# Altium schematic sheet Display LED 8x8(20.00) x4.SchDoc
size 209 x 297 mm; Author: Мурашкин Д.В.; Address1: Address1; Address2: Address2; Address3: Address3; Address4: Address4; DocumentNumber: АБВГ.123456.001 Э3; Scale: 1:1; Letter1Column: Э; PartName: Деталь
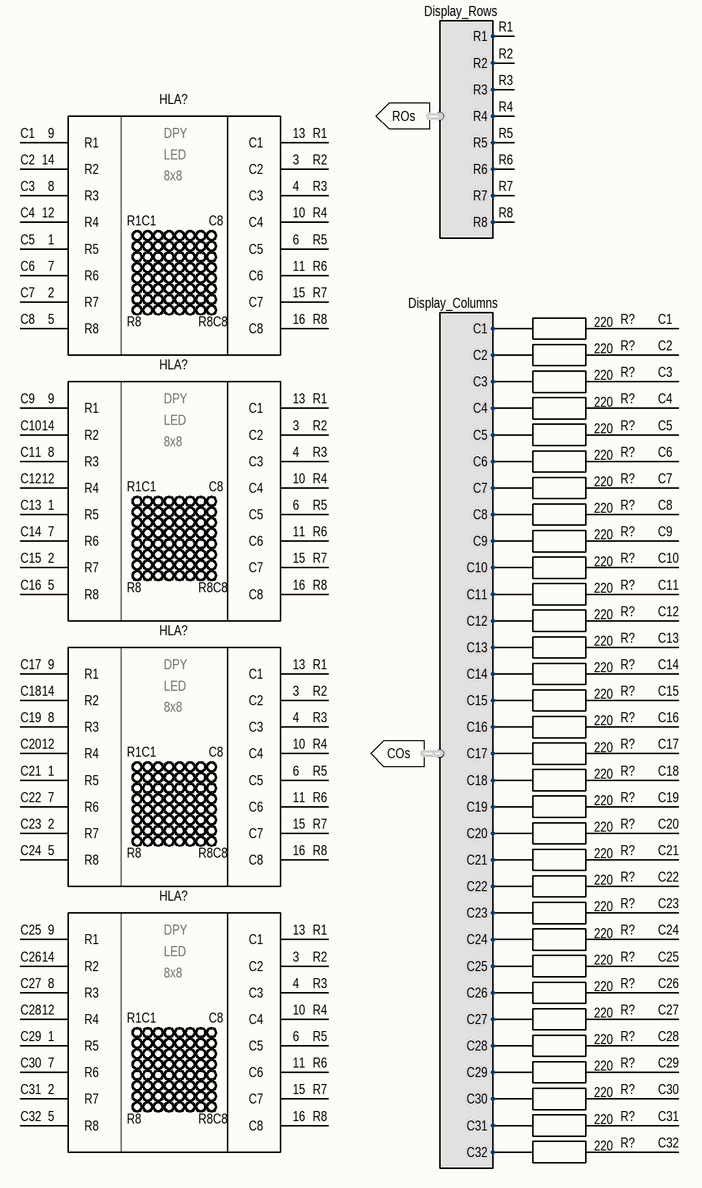
[diagram p0: Display LED 8x8(20.00) x4.SchDoc]

## Parts
(Parts that share a designator on the sheet are numbered #1, #2 ... from top to bottom, then left to right.)
HLA?#1  Blue  [DISP LED 8x8 1.9 DIP-16]  (value not drawn)
HLA?#2  Blue  [DISP LED 8x8 1.9 DIP-16]  (value not drawn)
HLA?#3  Blue  [DISP LED 8x8 1.9 DIP-16]  (value not drawn)
HLA?#4  Blue  [DISP LED 8x8 1.9 DIP-16]  (value not drawn)
R?#1  220  [RESC1608M]
R?#2  220  [RESC1608M]
R?#3  220  [RESC1608M]
R?#4  220  [RESC1608M]
R?#5  220  [RESC1608M]
R?#6  220  [RESC1608M]
R?#7  220  [RESC1608M]
R?#8  220  [RESC1608M]
R?#9  220  [RESC1608M]
R?#10  220  [RESC1608M]
R?#11  220  [RESC1608M]
R?#12  220  [RESC1608M]
R?#13  220  [RESC1608M]
R?#14  220  [RESC1608M]
R?#15  220  [RESC1608M]
R?#16  220  [RESC1608M]
R?#17  220  [RESC1608M]
R?#18  220  [RESC1608M]
R?#19  220  [RESC1608M]
R?#20  220  [RESC1608M]
R?#21  220  [RESC1608M]
R?#22  220  [RESC1608M]
R?#23  220  [RESC1608M]
R?#24  220  [RESC1608M]
R?#25  220  [RESC1608M]
R?#26  220  [RESC1608M]
R?#27  220  [RESC1608M]
R?#28  220  [RESC1608M]
R?#29  220  [RESC1608M]
R?#30  220  [RESC1608M]
R?#31  220  [RESC1608M]
R?#32  220  [RESC1608M]

## Ports
COs (harness Display_Columns), ROs (harness Display_Rows)

## Harnesses
Display_Rows: R1, R2, R3, R4, R5, R6, R7, R8
Display_Columns: C1, C2, C3, C4, C5, C6, C7, C8, C9, C10, C11, C12, C13, C14, C15, C16, C17, C18, C19, C20, C21, C22, C23, C24, C25, C26, C27, C28, C29, C30, C31, C32

## Nets
C1: HLA?#1.9(R1) R?#1.2
C2: HLA?#1.14(R2) R?#2.2
C3: HLA?#1.8(R3) R?#3.2
C4: HLA?#1.12(R4) R?#4.2
C5: HLA?#1.1(R5) R?#5.2
C6: HLA?#1.7(R6) R?#6.2
C7: HLA?#1.2(R7) R?#7.2
C8: HLA?#1.5(R8) R?#8.2
C9: HLA?#2.9(R1) R?#9.2
C10: HLA?#2.14(R2) R?#10.2
C11: HLA?#2.8(R3) R?#11.2
C12: HLA?#2.12(R4) R?#12.2
C13: HLA?#2.1(R5) R?#13.2
C14: HLA?#2.7(R6) R?#14.2
C15: HLA?#2.2(R7) R?#15.2
C16: HLA?#2.5(R8) R?#16.2
C17: HLA?#3.9(R1) R?#17.2
C18: HLA?#3.14(R2) R?#18.2
C19: HLA?#3.8(R3) R?#19.2
C20: HLA?#3.12(R4) R?#20.2
C21: HLA?#3.1(R5) R?#21.2
C22: HLA?#3.7(R6) R?#22.2
C23: HLA?#3.2(R7) R?#23.2
C24: HLA?#3.5(R8) R?#24.2
C25: HLA?#4.9(R1) R?#25.2
C26: HLA?#4.14(R2) R?#26.2
C27: HLA?#4.8(R3) R?#27.2
C28: HLA?#4.12(R4) R?#28.2
C29: HLA?#4.1(R5) R?#29.2
C30: HLA?#4.7(R6) R?#30.2
C31: HLA?#4.2(R7) R?#31.2
C32: HLA?#4.5(R8) R?#32.2
R1: HLA?#1.13(C1) HLA?#2.13(C1) HLA?#3.13(C1) HLA?#4.13(C1) ; port ROs.R1
R2: HLA?#1.3(C2) HLA?#2.3(C2) HLA?#3.3(C2) HLA?#4.3(C2) ; port ROs.R2
R3: HLA?#1.4(C3) HLA?#2.4(C3) HLA?#3.4(C3) HLA?#4.4(C3) ; port ROs.R3
R4: HLA?#1.10(C4) HLA?#2.10(C4) HLA?#3.10(C4) HLA?#4.10(C4) ; port ROs.R4
R5: HLA?#1.6(C5) HLA?#2.6(C5) HLA?#3.6(C5) HLA?#4.6(C5) ; port ROs.R5
R6: HLA?#1.11(C6) HLA?#2.11(C6) HLA?#3.11(C6) HLA?#4.11(C6) ; port ROs.R6
R7: HLA?#1.15(C7) HLA?#2.15(C7) HLA?#3.15(C7) HLA?#4.15(C7) ; port ROs.R7
R8: HLA?#1.16(C8) HLA?#2.16(C8) HLA?#3.16(C8) HLA?#4.16(C8) ; port ROs.R8
NetR?#1_1: R?#1.1 ; port COs.C1
NetR?#2_1: R?#2.1 ; port COs.C2
NetR?#3_1: R?#3.1 ; port COs.C3
NetR?#4_1: R?#4.1 ; port COs.C4
NetR?#5_1: R?#5.1 ; port COs.C5
NetR?#6_1: R?#6.1 ; port COs.C6
NetR?#7_1: R?#7.1 ; port COs.C7
NetR?#8_1: R?#8.1 ; port COs.C8
NetR?#9_1: R?#9.1 ; port COs.C9
NetR?#10_1: R?#10.1 ; port COs.C10
NetR?#11_1: R?#11.1 ; port COs.C11
NetR?#12_1: R?#12.1 ; port COs.C12
NetR?#13_1: R?#13.1 ; port COs.C13
NetR?#14_1: R?#14.1 ; port COs.C14
NetR?#15_1: R?#15.1 ; port COs.C15
NetR?#16_1: R?#16.1 ; port COs.C16
NetR?#17_1: R?#17.1 ; port COs.C17
NetR?#18_1: R?#18.1 ; port COs.C18
NetR?#19_1: R?#19.1 ; port COs.C19
NetR?#20_1: R?#20.1 ; port COs.C20
NetR?#21_1: R?#21.1 ; port COs.C21
NetR?#22_1: R?#22.1 ; port COs.C22
NetR?#23_1: R?#23.1 ; port COs.C23
NetR?#24_1: R?#24.1 ; port COs.C24
NetR?#25_1: R?#25.1 ; port COs.C25
NetR?#26_1: R?#26.1 ; port COs.C26
NetR?#27_1: R?#27.1 ; port COs.C27
NetR?#28_1: R?#28.1 ; port COs.C28
NetR?#29_1: R?#29.1 ; port COs.C29
NetR?#30_1: R?#30.1 ; port COs.C30
NetR?#31_1: R?#31.1 ; port COs.C31
NetR?#32_1: R?#32.1 ; port COs.C32

## Notes on the sheet
- Перв. примен.
- Справ. №
- Подп. и дата
- Инв. № дубл.
- Взам. инв. №
- Разраб.
- Изм.
- Лист
- № докум.
- Подп.
- Дата
- Лит.
- Масса
- Масштаб
- Пров.
- Т.контр.
- Листов
- Инв. № подл.
- Утв.
- Н.контр.
- 2.106-A4
- Копировал
- Формат А4
- (in symbol 788BB-3) DPY; LED; 8x8; R1C1; R8C8

## Library data of the parts
HLA?#1-HLA?#4 = 788BB-3: LED 8x8 1.9mm Blue TH; Group: LED Character and Numeric; Wavelength: 460nm; Common pin: Row Common Anode; Forward current: 20mA; Package: DIP-16 (15.0); Part name: 788BB-3; Color: Blue; Dimension: 19.75mm x 19.75mm; Thickness: 5.90mm
R?#1-R?#32 = RC0603JR-07220RL: 220 0603(1608); Manufacturer: Yageo; Group: Ceramic Resistors; Temperature Coefficient: ±100ppm/°C; Tolerance: ±5%; Power: 0.1W; Part name: RC0603JR-07220RL; Type: Thin Film; Package: 0603 (1608); Value: 220; Dimension: 1.60mm x 0.80mm; Thickness: 0.55mm; Operating Temperature: -55°C +155°C; Mounting Type: Surface mount